# Altium schematic sheet FlowControl.SchDoc
size B; SheetNumber: 5; SheetTotal: 7
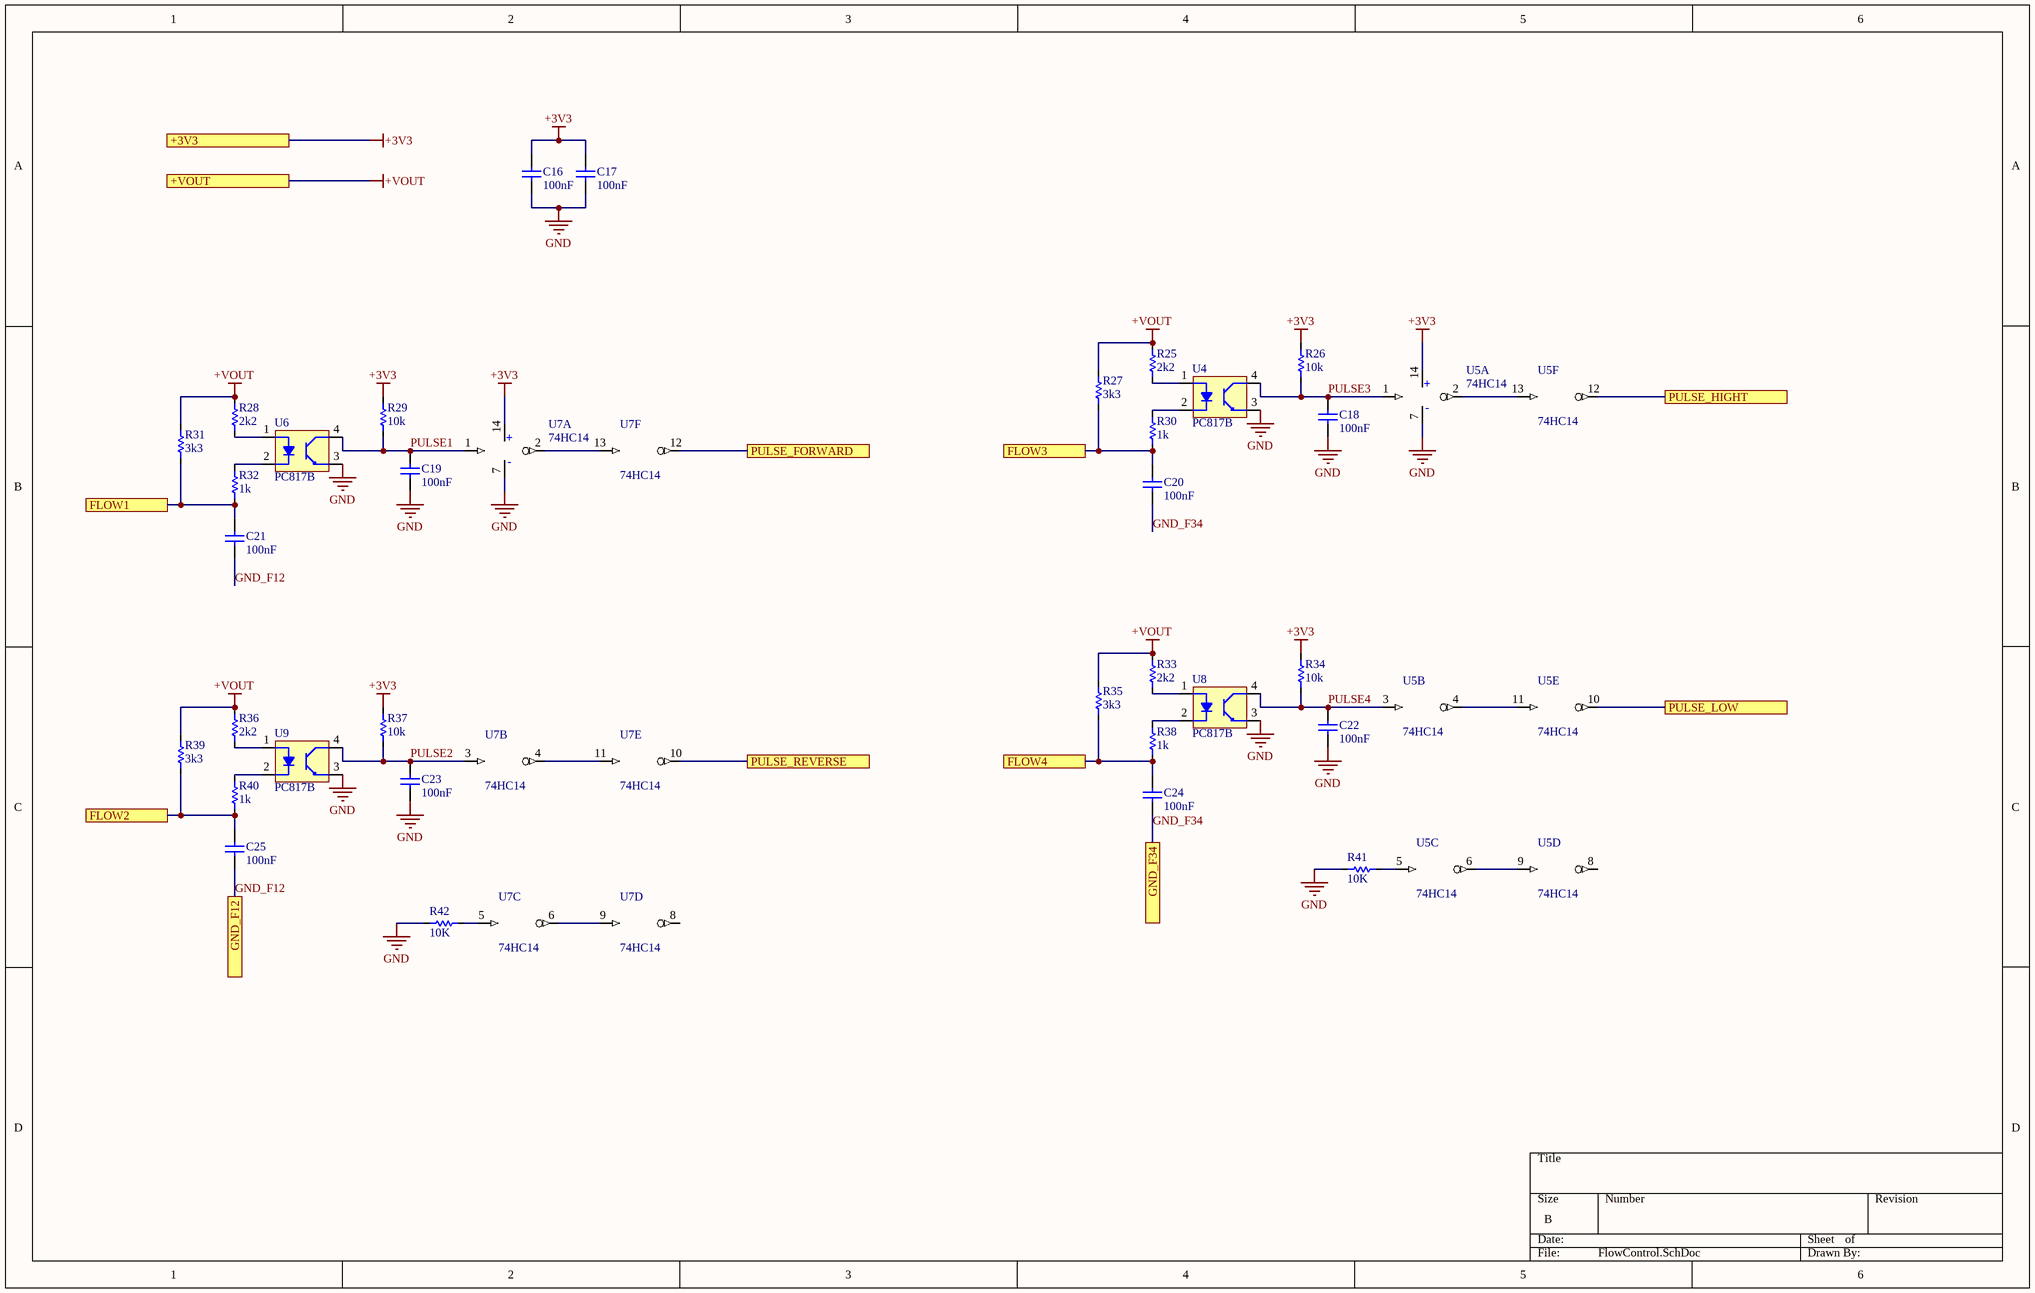
[diagram p0: FlowControl.SchDoc]

## Parts
C16  100nF  [C 0603 (1608)]
C17  100nF  [C 0603 (1608)]
C18  100nF  [C 0603 (1608)]
C19  100nF  [C 0603 (1608)]
C20  100nF  [C 0603 (1608)]
C21  100nF  [C 0603 (1608)]
C22  100nF  [C 0603 (1608)]
C23  100nF  [C 0603 (1608)]
C24  100nF  [C 0603 (1608)]
C25  100nF  [C 0603 (1608)]
R25  2k2  [R 0603 (1608)]
R26  10k  [R 0603 (1608)]
R27  3k3  [R 0603 (1608)]
R28  2k2  [R 0603 (1608)]
R29  10k  [R 0603 (1608)]
R30  1k  [R 0603 (1608)]
R31  3k3  [R 0603 (1608)]
R32  1k  [R 0603 (1608)]
R33  2k2  [R 0603 (1608)]
R34  10k  [R 0603 (1608)]
R35  3k3  [R 0603 (1608)]
R36  2k2  [R 0603 (1608)]
R37  10k  [R 0603 (1608)]
R38  1k  [R 0603 (1608)]
R39  3k3  [R 0603 (1608)]
R40  1k  [R 0603 (1608)]
R41  10K  [R 0603 (1608)]
R42  10K  [R 0603 (1608)]
U4  PC817B  [DIP 4]
U5  74HC14  [SOIC-14]  (parts A,B,C,D,E,F of 6)
U6  PC817B  [DIP 4]
U7  74HC14  [SOIC-14]  (parts A,B,C,D,E,F of 6)
U8  PC817B  [DIP 4]
U9  PC817B  [DIP 4]

## Ports
+3V3, +VOUT, FLOW1, FLOW2, FLOW3, FLOW4, GND_F12, GND_F34, PULSE_FORWARD, PULSE_HIGHT, PULSE_LOW, PULSE_REVERSE

## Nets
+3V3: C16.1 C17.1 R26.2 R29.2 R34.2 R37.2 U5.14(+) U7.14(+) ; port +3V3
+VOUT: R25.2 R27.2 R28.2 R31.2 R33.2 R35.2 R36.2 R39.2 ; port +VOUT
GND: C16.2 C17.2 C18.2 C19.2 C22.2 C23.2 R41.2 R42.2 U4.3(E) U5.7(GND) U6.3(E) U7.7(GND) U8.3(E) U9.3(E)
FLOW1: C21.1 R31.1 R32.1 ; port FLOW1
FLOW2: C25.1 R39.1 R40.1 ; port FLOW2
FLOW3: C20.1 R27.1 R30.1 ; port FLOW3
FLOW4: C24.1 R35.1 R38.1 ; port FLOW4
GND_F12: C21.2 C25.2 ; port GND_F12
GND_F34: C20.2 C24.2 ; port GND_F34
PULSE1: C19.1 R29.1 U6.4(C) U7.1(1A)
PULSE2: C23.1 R37.1 U7.3(2A) U9.4(C)
PULSE3: C18.1 R26.1 U4.4(C) U5.1(1A)
PULSE4: C22.1 R34.1 U5.3(2A) U8.4(C)
PULSE_FORWARD: U7.12(6Y) ; port PULSE_FORWARD
PULSE_HIGHT: U5.12(6Y) ; port PULSE_HIGHT
PULSE_LOW: U5.10(5Y) ; port PULSE_LOW
PULSE_REVERSE: U7.10(5Y) ; port PULSE_REVERSE
NetR25_1: R25.1 U4.1(A)
NetR28_1: R28.1 U6.1(A)
NetR30_2: R30.2 U4.2(K)
NetR32_2: R32.2 U6.2(K)
NetR33_1: R33.1 U8.1(A)
NetR36_1: R36.1 U9.1(A)
NetR38_2: R38.2 U8.2(K)
NetR40_2: R40.2 U9.2(K)
NetR41_1: R41.1 U5.5(3A)
NetR42_1: R42.1 U7.5(3A)
NetU5_2: U5.2(1Y) U5.13(6A)
NetU5_4: U5.4(2Y) U5.11(5A)
NetU5_6: U5.6(3Y) U5.9(4A)
NetU7_2: U7.2(1Y) U7.13(6A)
NetU7_4: U7.4(2Y) U7.11(5A)
NetU7_6: U7.6(3Y) U7.9(4A)

Not connected (* = marked no-connect by the designer): U5 8(4Y); U7 8(4Y)

## Notes on the sheet
- (in symbol 74HC14, part A) -

## Library data of the parts
C16-C25 = Capacitor NP: Capacitor non-pol
R25-R42 = Resistor: Published: 8-Jun-2000; LatestRevisionDate: 17-Jul-2002; LatestRevisionNote: Re-released for DXP Platform.; PackageReference: AXIAL-0.3; Publisher: Altium Limited
U4 U6 U8 U9 = Opto PC817B
U5 U7 = 74HC14: Hex inverting Schmitt trigger